# Altium project TSSOP-32,VSSOP-32,MSOP-32.PrjPcb
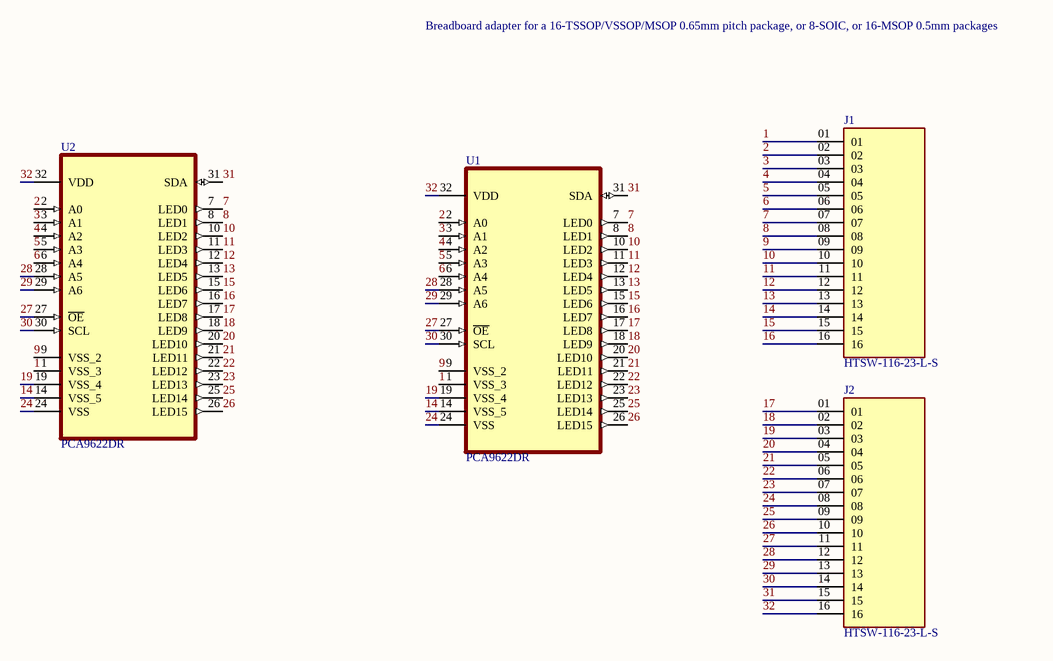
[diagram p0: Schematic.SchDoc]
1 sheet, 4 parts. Net scope: global (net labels, ports and power ports of the same name join across sheets).
Board file: PCB.PcbDoc

## Sheet Schematic.SchDoc
size A4

### Parts
J1  HTSW-116-23-L-S  [SAMTEC_HTSW-116-23-L-S]
J2  HTSW-116-23-L-S  [SAMTEC_HTSW-116-23-L-S]
U1  PCA9622DR  [SOP65P810X110-32N]
U2  PCA9622DR  [SOP65P810X110-32N-0.5mm]

### Nets
1: J1.01 U1.1(VSS_3) U2.1(VSS_3)
2: J1.02 U1.2(A0) U2.2(A0)
3: J1.03 U1.3(A1) U2.3(A1)
4: J1.04 U1.4(A2) U2.4(A2)
5: J1.05 U1.5(A3) U2.5(A3)
6: J1.06 U1.6(A4) U2.6(A4)
7: J1.07 U1.7(LED0) U2.7(LED0)
8: J1.08 U1.8(LED1) U2.8(LED1)
9: J1.09 U1.9(VSS_2) U2.9(VSS_2)
10: J1.10 U1.10(LED2) U2.10(LED2)
11: J1.11 U1.11(LED3) U2.11(LED3)
12: J1.12 U1.12(LED4) U2.12(LED4)
13: J1.13 U1.13(LED5) U2.13(LED5)
14: J1.14 U1.14(VSS_5) U2.14(VSS_5)
15: J1.15 U1.15(LED6) U2.15(LED6)
16: J1.16 U1.16(LED7) U2.16(LED7)
17: J2.01 U1.17(LED8) U2.17(LED8)
18: J2.02 U1.18(LED9) U2.18(LED9)
19: J2.03 U1.19(VSS_4) U2.19(VSS_4)
20: J2.04 U1.20(LED10) U2.20(LED10)
21: J2.05 U1.21(LED11) U2.21(LED11)
22: J2.06 U1.22(LED12) U2.22(LED12)
23: J2.07 U1.23(LED13) U2.23(LED13)
24: J2.08 U1.24(VSS) U2.24(VSS)
25: J2.09 U1.25(LED14) U2.25(LED14)
26: J2.10 U1.26(LED15) U2.26(LED15)
27: J2.11 U1.27(~{OE}) U2.27(~{OE})
28: J2.12 U1.28(A5) U2.28(A5)
29: J2.13 U1.29(A6) U2.29(A6)
30: J2.14 U1.30(SCL) U2.30(SCL)
31: J2.15 U1.31(SDA) U2.31(SDA)
32: J2.16 U1.32(VDD) U2.32(VDD)

### Notes on the sheet
- Breadboard adapter for a 16-TSSOP/VSSOP/MSOP 0.65mm pitch package, or 8-SOIC, or 16-MSOP 0.5mm packages

### Library data of the parts
U1 U2 = PCA9622DR: 16-bit Fm+ I2C-bus 100 mA 40 V LED driver; Package: None; Price: None; Value: *; MP: PCA9622DR; Availability: Unavailable
J1 J2 = HTSW-116-23-L-S: Price: None; Availability: Unavailable; MP: HTSW-116-23-L-S; Value: *; Package: None